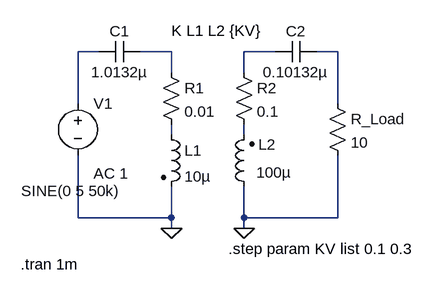
[diagram p0: schematic KAPSEL-TRAN-ANALYSIS.asc]
KAPSEL-TRAN-ANALYSIS.asc, the LTspice schematic file:
Version 4
SHEET 1 880 680
WIRE 32 -16 0 -16
WIRE 144 -16 96 -16
WIRE 304 -16 256 -16
WIRE 400 -16 368 -16
WIRE 144 16 144 -16
WIRE 256 16 256 -16
WIRE 0 64 0 -16
WIRE 400 64 400 -16
WIRE 144 112 144 96
WIRE 256 112 256 96
WIRE 0 240 0 144
WIRE 144 240 144 192
WIRE 144 240 0 240
WIRE 256 240 256 192
WIRE 400 240 400 144
WIRE 400 240 256 240
WIRE 144 256 144 240
WIRE 256 256 256 240
FLAG 144 256 0
FLAG 256 256 0
SYMBOL ind2 128 96 R0
SYMATTR InstName L1
SYMATTR Value 10µ
SYMATTR Type ind
SYMBOL ind2 272 208 R180
WINDOW 0 -33 81 Left 2
WINDOW 3 -57 38 Left 2
SYMATTR InstName L2
SYMATTR Value 100µ
SYMATTR Type ind
SYMBOL res 384 48 R0
SYMATTR InstName R_Load
SYMATTR Value 10
SYMBOL res 128 0 R0
SYMATTR InstName R1
SYMATTR Value 0.01
SYMBOL res 240 0 R0
SYMATTR InstName R2
SYMATTR Value 0.1
SYMBOL voltage 0 48 R0
WINDOW 3 -87 151 Left 2
WINDOW 123 24 124 Left 2
WINDOW 39 0 0 Left 0
SYMATTR InstName V1
SYMATTR Value SINE(0 5 50k)
SYMATTR Value2 AC 1
SYMBOL cap 96 -32 R90
WINDOW 0 0 32 VBottom 2
WINDOW 3 32 32 VTop 2
SYMATTR InstName C1
SYMATTR Value 1.0132µ
SYMBOL cap 368 -32 R90
WINDOW 0 0 32 VBottom 2
WINDOW 3 32 32 VTop 2
SYMATTR InstName C2
SYMATTR Value 0.10132µ
TEXT 144 -48 Left 2 !K L1 L2 {KV}
TEXT 232 288 Left 2 !.step param KV list 0.1 0.3
TEXT -88 312 Left 2 !.tran 1m

The netlist it stands for:
* KAPSEL-TRAN-ANALYSIS.asc
L1 N005 0 10µ
L2 0 N006 100µ
R_Load N004 0 10
R1 N002 N005 0.01
R2 N003 N006 0.1
V1 N001 0 SINE(0 5 50k) AC 1
C1 N002 N001 1.0132µ
C2 N004 N003 0.10132µ
K L1 L2 {KV}
.step param KV list 0.1 0.3
.tran 1m
.backanno
.end